# EAGLE board Arduino_kuukulgur-alternatiivne (EAGLE 6.3)
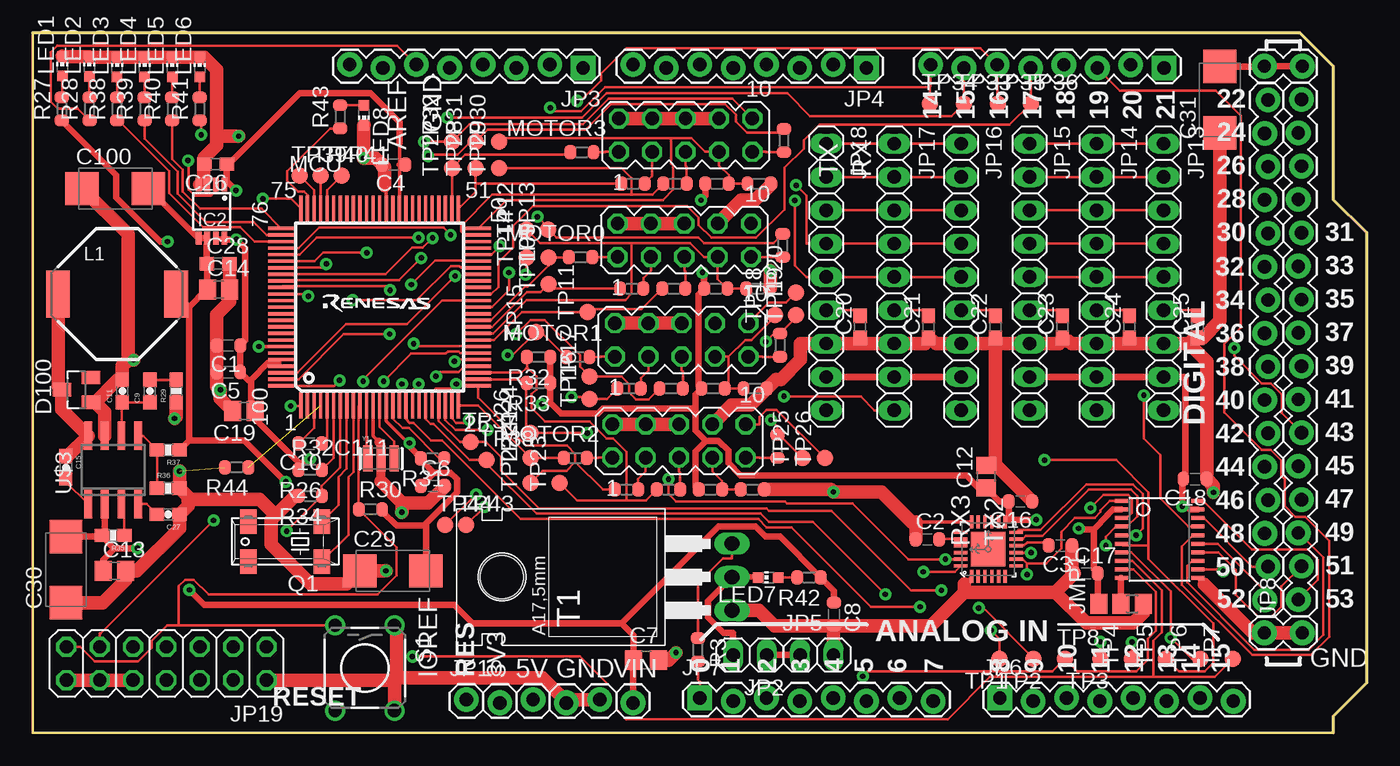
[diagram p7: board, top side]
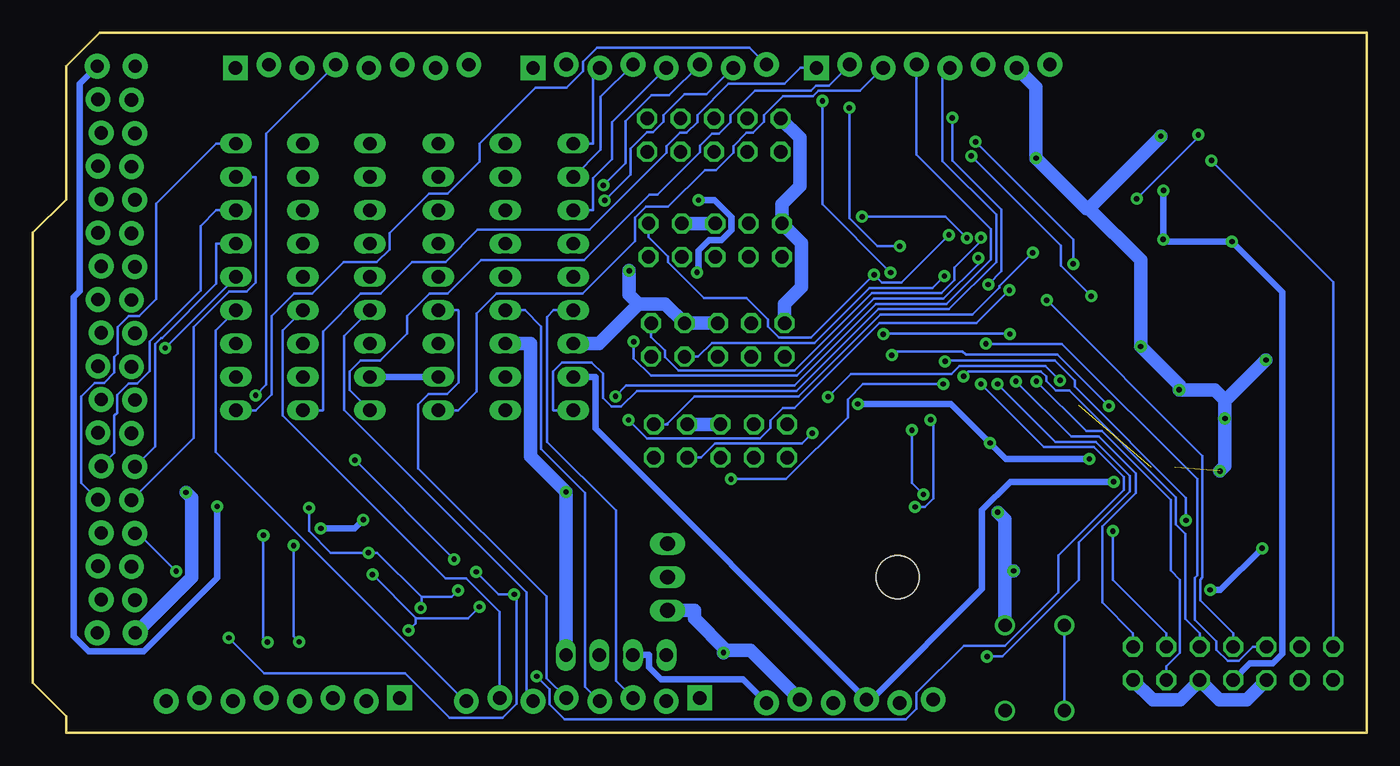
[diagram p8: board, bottom side, seen from below]

Size 101.6 x 53.34 mm. Coordinates in mm from the lower left corner, seen from the top.
Outline: 0,0 99.06,0 99.06,1.27 101.6,3.81 101.6,38.1 99.06,40.64 99.06,50.8 96.52,53.34 0,53.34 0,0
Copper layers (1*16): Top 0.035mm / dielectric 1.5mm / Bottom 0.035mm
Design rules "default": minimum track width 8mil, minimum drill 16mil, track to track 6mil, track to pad 7mil, pad to pad 8mil, via to via 10mil, smd to smd 7mil, copper to edge 27mil, drill to drill 12mil, minimum pad ring 10mil, minimum via ring 10mil, stop-mask expansion 2mil, vias tented up to drill 24mil, thermal gap 10mil
Net classes: 0 default: width 0.203 mm, drill 0.203 mm, clearance 0.203 mm; 1 power: width 0.508 mm, drill 0.508 mm, clearance 0.203 mm; 2 morepower: width 1.016 mm, drill 0.508 mm, clearance 0.203 mm; 3 gnd: width 0.305 mm, drill 0.305 mm, clearance 0.203 mm

## Footprints (pad centres in the part's own frame; a part is rotated, then mirrored left to right if it is on the bottom)
C0603-ROUND = smd 0.898 x 1.1: 1 -0.889,0; 2 0.889,0
C0805 = smd 1.3 x 1.5: 1 -0.95,0; 2 0.95,0
0603-CAP = smd 1.1 x 1: 1 -0.85,0; 2 0.85,0
C0805' = smd 1.3 x 1.5: 1 -0.85,0; 2 0.85,0
C0603 = smd 1.1 x 1: 1 -0.85,0; 2 0.85,0
C/6032-28R = smd 2.55 x 2.5: + 2.525,0; - -2.525,0
SOT23 = smd 1 x 1.4: 1 -0.95,-1.1; 2 0.95,-1.1; 3 0,1.1
MSOP8 = smd 0.45 x 1: 1 -0.975,-2.05; 2 -0.325,-2.05; 3 0.325,-2.05; 4 0.975,-2.05; 5 0.975,2.05; 6 0.325,2.05; 7 -0.325,2.05; 8 -0.975,2.05
B0R-JMP = smd 1.5 x 1.3: 1 0,1.7; 2 0,0; 3 0,-1.7
1X08_LOCK = drill 1.016 pad 1.88 square: 1 0,0.127 | drill 1.016 pad 1.88: 2 2.54,-0.127; 3 5.08,0.127; 4 7.62,-0.127; 5 10.16,0.127; 6 12.7,-0.127; 7 15.24,0.127; 8 17.78,-0.127
1X02 = drill 1.016 long: 1 -1.27,0; 2 1.27,0
1X16_LOCK = drill 1.016 pad 1.88: 1 0,0.127; 2 2.54,-0.127; 3 5.08,0.127; 4 7.62,-0.127; 5 10.16,0.127; 6 12.7,-0.127; 7 15.24,0.127; 8 17.78,-0.127; 9 20.32,0.127; 10 22.86,-0.127; 11 25.4,0.127; 12 27.94,-0.127; 13 30.48,0.127; 14 33.02,-0.127; 15 35.56,0.127; 16 38.1,-0.127
1X06_LOCK = drill 1.016 pad 1.88: 1 0,0; 2 2.54,-0.254; 3 5.08,0; 4 7.62,-0.254; 5 10.16,0; 6 12.7,-0.254
1X02_LOCK = drill 1.016 pad 1.88: 1 -0.178,0; 2 2.718,0
1X09 = drill 1.016 long: 1 -10.16,0; 2 -7.62,0; 3 -5.08,0; 4 -2.54,0; 5 0,0; 6 2.54,0; 7 5.08,0; 8 7.62,0; 9 10.16,0
2X07 = drill 1.016 octagon: 1 -7.62,-1.27; 2 -7.62,1.27; 3 -5.08,-1.27; 4 -5.08,1.27; 5 -2.54,-1.27; 6 -2.54,1.27; 7 0,-1.27; 8 0,1.27; 9 2.54,-1.27; 10 2.54,1.27; 11 5.08,-1.27; 12 5.08,1.27; 13 7.62,-1.27; 14 7.62,1.27
SRU1038 = smd 1.8 x 3.6: 1 -4.5,0; 2 4.5,0
CHIP-LED0603 = smd 0.8 x 0.8: A 0,-0.75; C 0,0.75
100P6Q-A = smd 0.25 x 2: 1 -6,-7.5; 2 -5.5,-7.5; 3 -5,-7.5; 4 -4.5,-7.5; 5 -4,-7.5; 6 -3.5,-7.5; 7 -3,-7.5; 8 -2.5,-7.5; 9 -2,-7.5; 10 -1.5,-7.5; 11 -1,-7.5; 12 -0.5,-7.5; 13 0,-7.5; 14 0.5,-7.5; 15 1,-7.5; 16 1.5,-7.5; 17 2,-7.5; 18 2.5,-7.5; 19 3,-7.5; 20 3.5,-7.5; 21 4,-7.5; 22 4.5,-7.5; 23 5,-7.5; 24 5.5,-7.5; 25 6,-7.5; 51 6,7.5; 52 5.5,7.5; 53 5,7.5; 54 4.5,7.5; 55 4,7.5; 56 3.5,7.5; 57 3,7.5; 58 2.5,7.5; 59 2,7.5; 60 1.5,7.5; 61 1,7.5; 62 0.5,7.5; 63 0,7.5; 64 -0.5,7.5; 65 -1,7.5; 66 -1.5,7.5; 67 -2,7.5; 68 -2.5,7.5; 69 -3,7.5; 70 -3.5,7.5; 71 -4,7.5; 72 -4.5,7.5; 73 -5,7.5; 74 -5.5,7.5; 75 -6,7.5 | smd 2 x 0.25: 26 7.5,-6; 27 7.5,-5.5; 28 7.5,-5; 29 7.5,-4.5; 30 7.5,-4; 31 7.5,-3.5; 32 7.5,-3; 33 7.5,-2.5; 34 7.5,-2; 35 7.5,-1.5; 36 7.5,-1; 37 7.5,-0.5; 38 7.5,0; 39 7.5,0.5; 40 7.5,1; 41 7.5,1.5; 42 7.5,2; 43 7.5,2.5; 44 7.5,3; 45 7.5,3.5; 46 7.5,4; 47 7.5,4.5; 48 7.5,5; 49 7.5,5.5; 50 7.5,6; 76 -7.5,6; 77 -7.5,5.5; 78 -7.5,5; 79 -7.5,4.5; 80 -7.5,4; 81 -7.5,3.5; 82 -7.5,3; 83 -7.5,2.5; 84 -7.5,2; 85 -7.5,1.5; 86 -7.5,1; 87 -7.5,0.5; 88 -7.5,0; 89 -7.5,-0.5; 90 -7.5,-1; 91 -7.5,-1.5; 92 -7.5,-2; 93 -7.5,-2.5; 94 -7.5,-3; 95 -7.5,-3.5; 96 -7.5,-4; 97 -7.5,-4.5; 98 -7.5,-5; 99 -7.5,-5.5; 100 -7.5,-6
MA05-2 = drill 1.016 octagon: 1 -5.08,-1.27; 2 -5.08,1.27; 3 -2.54,-1.27; 4 -2.54,1.27; 5 0,-1.27; 6 0,1.27; 7 2.54,-1.27; 8 2.54,1.27; 9 5.08,-1.27; 10 5.08,1.27
MM20SS = smd 1.27 x 1.88: 1 -2.794,-1.524; 2 2.794,-1.524; 3 2.794,1.524; 4 -2.794,1.524
R0603-ROUND = smd 0.898 x 1.1: 1 -0.889,0; 2 0.889,0
0603-RES = smd 1.1 x 1: 1 -0.85,0; 2 0.85,0
TACTILE-PTH = drill 1.016: 1 -3.251,2.261; 2 3.251,2.261; 3 -3.251,-2.261; 4 3.251,-2.261
TO220 = drill 1.118 long: 1 -2.54,-6.35; 2 0,-6.35; 3 2.54,-6.35 | hole 3.302: 0,11.176
B1,27 = smd 1.27 x 1.27: TP 0,0
QFN-24-TESTING = smd 1.016 x 0.254: 1 -2.066,1.257; 2 -2.066,0.75; 3 -2.066,0.247; 4 -2.066,-0.287; 5 -2.066,-0.792; 6 -2.066,-1.297; 13 2.086,-1.297; 14 2.086,-0.792; 15 2.086,-0.287; 16 2.086,0.247; 17 2.086,0.75; 18 2.086,1.257 | smd 0.254 x 1.016: 7 -1.267,-2.122; 8 -0.762,-2.122; 9 -0.258,-2.122; 10 0.278,-2.122; 11 0.78,-2.122; 12 1.287,-2.122; 19 1.287,2.082; 20 0.78,2.082; 21 0.278,2.082; 22 -0.258,2.082; 23 -0.762,2.082; 24 -1.267,2.082 | smd 2.616 x 2.616: P$1 0.02,-0.01
TSSOP20 = smd 0.305 x 0.991: 1 -2.925,-2.918; 2 -2.275,-2.918; 3 -1.625,-2.918; 4 -0.975,-2.918; 5 -0.325,-2.918; 6 0.325,-2.918; 7 0.975,-2.918; 8 1.625,-2.918; 9 2.275,-2.918; 10 2.925,-2.918; 11 2.925,2.918; 12 2.275,2.918; 13 1.625,2.918; 14 0.975,2.918; 15 0.325,2.918; 16 -0.325,2.918; 17 -0.975,2.918; 18 -1.625,2.918; 19 -2.275,2.918; 20 -2.925,2.918
SO8 = smd 0.6 x 2.2: 1 -1.905,-2.6; 2 -0.635,-2.6; 3 0.635,-2.6; 4 1.905,-2.6; 5 1.905,2.6; 6 0.635,2.6; 7 -0.635,2.6; 8 -1.905,2.6
RESONATOR = smd 0.7 x 2: 1 -1,0; 2 0,0; 3 1,0

## Placement (x,y rotation side)
C1  100n  [C0603-ROUND]  14.91,29.52 180 top
C2  2.2nF, 50V  [C0603-ROUND]  68.14,14.74 0 top
C3  100n  [C0603-ROUND]  78.26,14.27 180 top
C4  100n  [C0603-ROUND]  27.48,43.31 180 top
C5  100n  [C0603-ROUND]  14.91,27.49 180 top
C6  100n  [C0603-ROUND]  30.46,18.8 0 top
C7  47uF/16V  [C0805]  46.72,5.54 0 top
C8  100n  [C0603-ROUND]  61.02,9.04 270 top
C9  180pF  [0603-CAP]  8.92,26.04 90 top
C10  4,7uF  [C0603-ROUND]  21.12,22.04 180 top
C11  12pF  [0603-CAP]  6.82,26.04 90 top
C12  47uF  [C0805']  72.6,19.53 90 top
C13  47uF/16V  [C0805']  6.22,12.34 0 top
C14  47uF  [C0805']  14.16,33.78 0 top
C15  0.1  [0603-CAP]  2.52,20.24 270 top
C16  100n  [C0603-ROUND]  75.22,17.64 180 top
C17  100n  [C0603-ROUND]  80.22,12.14 0 top
C18  100n  [C0603-ROUND]  88.52,19.34 180 top
C19  47uF  [C0805']  16.08,24.53 180 top
C20  [C0603]  63.02,30.94 90 top
C21  [C0603]  68.22,30.94 90 top
C22  [C0603]  73.32,30.94 90 top
C23  [C0603]  78.42,30.94 90 top
C24  [C0603]  83.52,30.94 90 top
C25  [C0603]  88.72,30.94 90 top
C26  1uF/6V  [C0603]  13.92,43.34 180 top
C27  15nF  [0603-CAP]  10.32,16.64 180 top
C28  1uF/6V  [C0603]  14.12,35.74 0 top
C29  47uF/16V  [C/6032-28R]  27.42,12.34 0 top
C30  47uF/16V  [C/6032-28R]  2.52,12.44 90 top
C31  47uF/10V  [C/6032-28R]  90.42,48.24 90 top
C100  47uF/10V  [C/6032-28R]  6.29,41.47 0 top
D100  BAT54  [SOT23]  3.32,26.14 90 top
IC2  TPS77333DGK  [MSOP8]  13.62,39.74 180 top
JMP1  0R-JUMPB  [B0R-JMP]  82.89,9.83 90 top
JP1  [1X08_LOCK]  86.16,50.78 180 top
JP2  [1X02]  54.62,5.94 180 top
JP3  [1X08_LOCK]  41.91,50.8 180 top
JP4  [1X08_LOCK]  63.5,50.8 180 top
JP5  [1X02]  59.72,5.94 0 top
JP6  [1X08_LOCK]  73.66,2.54 0 top
JP7  [1X08_LOCK]  50.8,2.54 0 top
JP8  M16LOCK  [1X16_LOCK]  96.52,10.16 90 top
JP9  M16LOCK  [1X16_LOCK]  93.96,48.22 270 top
JP10  [1X06_LOCK]  33.02,2.54 0 top
JP11  [1X02_LOCK]  93.98,7.62 0 top
JP12  [1X02_LOCK]  93.98,50.8 0 top
JP13  [1X09]  86.12,34.74 270 top
JP14  [1X09]  81.02,34.74 270 top
JP15  [1X09]  75.92,34.74 270 top
JP16  [1X09]  70.72,34.74 270 top
JP17  [1X09]  65.62,34.74 270 top
JP18  [1X09]  60.42,34.74 270 top
JP19  [2X07]  10.18,5.29 180 top
L1  [SRU1038]  6.42,33.44 0 top
LED1  Red  [CHIP-LED0603]  2.25,50.79 0 top
LED2  Green  [CHIP-LED0603]  4.31,50.78 0 top
LED3  Green  [CHIP-LED0603]  6.42,50.74 0 top
LED4  Green  [CHIP-LED0603]  8.52,50.74 0 top
LED5  Green  [CHIP-LED0603]  10.62,50.74 0 top
LED6  Green  [CHIP-LED0603]  12.72,50.74 0 top
LED7  Yellow  [CHIP-LED0603]  56.02,11.84 90 top
LED8  Green  [CHIP-LED0603]  25.22,47.04 180 top
MCU  R32C111  [100P6Q-A]  26.42,32.44 0 top
MOTOR0  [MA05-2]  49.62,37.54 0 top
MOTOR1  [MA05-2]  49.42,29.94 0 top
MOTOR2  [MA05-2]  49.22,22.24 0 top
MOTOR3  [MA05-2]  49.72,45.54 0 top
Q1  [MM20SS]  19.22,14.58 180 top
R1  82R  [R0603-ROUND]  48.62,26.24 0 top
R2  82R  [R0603-ROUND]  48.82,33.84 0 top
R3  1k2  [R0603-ROUND]  50.66,6.34 270 top
R4  220R  [R0603-ROUND]  55.02,26.24 0 top
R5  220R  [R0603-ROUND]  51.82,26.24 0 top
R6  82R  [R0603-ROUND]  45.42,26.24 0 top
R7  180R  [R0603-ROUND]  41.52,28.64 0 top
R8  220R  [R0603-ROUND]  56.92,29.54 90 top
R9  220R  [R0603-ROUND]  55.22,33.84 0 top
R10  220R  [R0603-ROUND]  52.02,33.84 0 top
R11  82R  [R0603-ROUND]  45.62,33.84 0 top
R12  180R  [R0603-ROUND]  41.72,36.24 0 top
R13  220R  [R0603-ROUND]  57.12,37.14 90 top
R14  82R  [R0603-ROUND]  48.92,41.84 0 top
R15  220R  [R0603-ROUND]  55.32,41.84 0 top
R16  220R  [R0603-ROUND]  52.12,41.84 0 top
R17  82R  [R0603-ROUND]  45.72,41.84 0 top
R18  180R  [R0603-ROUND]  41.82,44.24 0 top
R19  220R  [R0603-ROUND]  57.22,45.14 90 top
R20  82R  [R0603-ROUND]  48.42,18.54 0 top
R21  220R  [R0603-ROUND]  54.82,18.54 0 top
R22  220R  [R0603-ROUND]  51.62,18.54 0 top
R23  82R  [R0603-ROUND]  45.22,18.54 0 top
R24  180R  [R0603-ROUND]  41.32,20.94 0 top
R25  220R  [R0603-ROUND]  56.72,21.84 90 top
R26  4k7  [R0603-ROUND]  21.12,20.04 180 top
R27  330r  [R0603-ROUND]  2.22,47.54 90 top
R28  330r  [R0603-ROUND]  4.32,47.54 90 top
R29  63k4  [0603-RES]  10.92,26.04 90 top
R30  4k7  [R0603-ROUND]  25.72,17.04 0 top
R31  4k7  [R0603-ROUND]  30.45,20.93 180 top
R32  4k7  [R0603-ROUND]  38.52,28.64 180 top
R33  4k7  [R0603-ROUND]  38.52,26.64 180 top
R34  4k7  [R0603-ROUND]  21.12,18.04 180 top
R35  100k  [0603-RES]  6.12,15.04 180 top
R36  1k87  [0603-RES]  10.32,18.64 0 top
R37  10k  [0603-RES]  10.32,21.57 180 top
R38  330r  [R0603-ROUND]  6.42,47.54 90 top
R39  330r  [R0603-ROUND]  8.52,47.54 90 top
R40  330r  [R0603-ROUND]  10.62,47.54 90 top
R41  330r  [R0603-ROUND]  12.72,47.54 90 top
R42  1k  [R0603-ROUND]  59.12,11.84 180 top
R43  330r  [R0603-ROUND]  23.42,46.94 90 top
R44  47k  [R0603-ROUND]  15.52,20.24 180 top
S1  [TACTILE-PTH]  25.29,4.94 270 top
T1  BD651  [TO220]  46.9,11.87 90 top
TP1  TPB1,27  [B1,27]  73.62,5.64 180 top
TP2  TPB1,27  [B1,27]  76.22,5.64 180 top
TP3  TPB1,27  [B1,27]  81.32,5.64 180 top
TP4  TPB1,27  [B1,27]  83.72,5.64 90 top
TP5  TPB1,27  [B1,27]  86.32,5.64 90 top
TP6  TPB1,27  [B1,27]  88.92,5.64 90 top
TP7  TPB1,27  [B1,27]  91.42,5.64 90 top
TP8  TPB1,27  [B1,27]  78.62,5.64 0 top
TP9  TPB1,27  [B1,27]  39.28,36.2 90 top
TP10  TPB1,27  [B1,27]  39.28,34.2 90 top
TP11  TPB1,27  [B1,27]  42.25,32.07 90 top
TP12  TPB1,27  [B1,27]  37.6,38.35 90 top
TP13  TPB1,27  [B1,27]  39.26,38.34 90 top
TP14  TPB1,27  [B1,27]  37.6,36.2 90 top
TP15  TPB1,27  [B1,27]  38.32,30.54 90 top
TP16  TPB1,27  [B1,27]  42.42,25.44 90 top
TP17  TPB1,27  [B1,27]  42.42,27.14 90 top
TP18  TPB1,27  [B1,27]  56.52,31.84 90 top
TP19  TPB1,27  [B1,27]  58.12,31.84 90 top
TP20  TPB1,27  [B1,27]  58.12,33.54 90 top
TP21  TPB1,27  [B1,27]  37.92,20.94 90 top
TP22  TPB1,27  [B1,27]  37.92,19.04 90 top
TP23  TPB1,27  [B1,27]  40.12,19.04 90 top
TP24  TPB1,27  [B1,27]  37.92,22.84 90 top
TP25  TPB1,27  [B1,27]  58.62,20.94 90 top
TP26  TPB1,27  [B1,27]  60.32,20.94 90 top
TP27  TPB1,27  [B1,27]  31.92,43.04 90 top
TP28  TPB1,27  [B1,27]  33.72,43.04 90 top
TP29  TPB1,27  [B1,27]  35.52,43.04 90 top
TP30  TPB1,27  [B1,27]  35.52,45.04 90 top
TP31  TPB1,27  [B1,27]  33.72,45.04 90 top
TP32  TPB1,27  [B1,27]  31.92,45.04 90 top
TP33  TPB1,27  [B1,27]  70.92,47.94 0 top
TP34  TPB1,27  [B1,27]  68.32,47.94 0 top
TP35  TPB1,27  [B1,27]  73.52,47.94 0 top
TP36  TPB1,27  [B1,27]  76.02,47.94 0 top
TP37  TPB1,27  [B1,27]  33.34,22.15 0 top
TP38  TPB1,27  [B1,27]  34.57,20.8 0 top
TP39  TPB1,27  [B1,27]  20.32,42.44 0 top
TP40  TPB1,27  [B1,27]  21.92,42.44 0 top
TP41  TPB1,27  [B1,27]  23.52,42.44 0 top
TP43  TPB1,27  [B1,27]  33.02,15.84 0 top
TP44  TPB1,27  [B1,27]  31.42,15.84 0 top
U1  MPU-6000QFN-24  [QFN-24-TESTING]  72.77,13.99 90 top
U2  txb0108  [TSSOP20]  85.82,14.74 270 top
U$3  TPS54233  [SO8]  6.12,20.04 0 top
Y1  CSTCE8M00G15C99-R0  [RESONATOR]  26.52,20.91 0 top

## Tracks (layer width: path | path; a pad name or v marks a point on that pad's centre or on a via)
+3V3  (via drill 0.41 pad 0.91)
  Top 0.203: 14.77,41.88 14.77,42.1 | IC2.1 14.68,41.88
  Top 0.25: MCU.60 27.92,43.31 27.92,44.92 | MCU.14 26.92,23.77 28.6,22.09 v28.69,22.09 | MCU.97 18.69,28.17 18.69,28.21 MCU.96
  Top 0.254: 74.28,16.29 U1.13
  Top 0.3: IC2.7 IC2.8
  Top 0.508: 39.41,25.17 38.87,25.17 v38.77,25.06 | 50.49,24.73 43.44,24.73 43.05,24.34 40.23,24.34 39.41,25.17 | 39.41,25.17 R33.1 R32.1 | 20.38,20.46 20.8,20.87 v21.12,20.87 | R30.2 26.61,16.89 27.7,15.8 29.95,15.8 | 29.95,15.8 29.95,15.96 32.31,18.33 32.31,19.33 31.83,19.81 30.58,19.81 | C29.+ 29.95,15.8 | 20.38,20.46 20.23,20.3 R26.2 | 17.09,24.38 C19.1 16.61,24.85 16.61,26.88 | 17.09,24.38 | 17.09,24.38 17.09,23.75 20.38,20.46 | 51.28,22.24 52.24,22.24 52.98,21.5 52.98,20.56 53.91,19.63 71.09,19.63 72.04,18.68 C12.1 73.64,17.64 C16.2 74.33,16.29 | v15.48,41.33 14.93,41.88 14.77,41.88 14.68,41.88 | IC2.8 14.69,37.59 v15.51,37.59 16.16,36.93 16.16,29.89 C1.1 C5.1 16.41,26.88 16.61,26.88 | 18.69,28.17 17.9,28.17 16.61,26.88 | v10.27,37.43 9.72,37.43 6.36,40.79 6.36,42.51 R27.1 | v28.69,22.09 28.69,21.81 R31.2 29.56,20.82 30.58,19.81 | 74.33,16.29 74.28,16.29 | v76.43,16.24 74.38,16.24 74.33,16.29 | 30.58,19.81 C6.1 | 51.28,22.24 50.49,21.45 50.49,18.78 R22.1 | 51.28,22.24 50.49,23.04 50.49,24.73 | 50.49,24.73 50.49,25.8 R5.1 50.69,26.48 50.69,33.4 R10.1 51.13,34.96 v51.01,35.09 | v50.89,40.59 51.23,40.93 R16.1 | JMP1.1 81.11,9.91 C17.2 80.81,12.44 80.81,15.52 | 14.77,42.1 C26.1 14.92,43.34 20.31,48.74 25.72,48.74 27.92,46.54 27.92,44.92 | 27.92,43.31 C4.1 | v79.67,15.58 79.73,15.52 80.81,15.52 | 80.81,15.52 81.88,16.6 81.88,16.64 82.26,17.02 U2.2
  Bottom 0.508: v38.77,25.06 31.66,25.06 v28.69,22.09 27.47,20.87 v21.12,20.87 | v15.48,41.33 15.51,41.3 v15.51,37.59 15.34,37.43 v10.27,37.43 6.42,33.58 6.42,6.02 7.15,5.29 8.91,5.29 JP19.8 | v50.89,40.59 49.66,40.59 48.38,39.31 48.38,38.29 49.13,37.54 50.1,37.54 50.89,36.76 50.89,35.21 v51.01,35.09 | v76.43,16.24 77.09,15.58 v79.67,15.58
+5V  (via drill 0.41 pad 0.91)
  Top 0.203: 13.25,37.2 13.29,37.24 IC2.6 12.97,37.69
  Top 0.305: 87.78,17.26 87.89,17.26 88.14,17.02
  Top 0.508: 11.9,22.3 16.1,22.3 v19.27,19.13 | 11.9,22.3 R37.1 | 11.9,32.46 11.9,22.3 | JP16.8 JP17.8 JP18.8 | 87.61,19.23 87.59,19.08 87.56,18.91 v87.56,17.26 87.78,17.26 | 87.61,19.23 | 87.61,19.23 C18.2 87.8,19.51 87.8,27.12 JP13.8 JP14.8 JP15.8 | C31.+ 93.77,50.77 JP12.1 JP12.2 | U2.19 88.14,17.02 | 12.97,37.69 IC2.5 12.6,37.69 C100.+ | L1.2 11.9,32.46 | 13.25,37.2 13.25,35.76 C28.1 13.27,33.78 | 11.9,32.46 13.22,33.78 13.27,33.78 | 13.27,33.78 C14.1
  Bottom 0.508: v19.27,19.13 27.15,19.13 29.3,16.97 29.3,10.97 37.73,2.54 JP10.3 58.74,23.18 58.74,27.12 JP18.8 | JP12.2 98.04,49.45 98.04,33.66 98.48,33.22 98.48,7.36 97.34,6.22 93.15,6.22 87.56,11.8 v87.56,17.26 | JP15.8 JP16.8
_CLK0
  Top 0.203: MCU.35 34.98,30.94 37.65,33.61 38.69,33.61 TP10.TP 39.75,33.84 R11.1
_CLK2
  Top 0.203: R23.1 43.42,18.54 41.32,20.64 | 41.32,20.64 41.32,21.25 40.68,21.89 37.58,21.89 33.92,25.55 MCU.26 | TP22.TP 38.84,19.96 40.64,19.96 41.32,20.64
_CLK3
  Top 0.203: 33.72,41.84 33.72,41.24 MCU.51 | TP28.TP 33.72,41.84 | R17.1 33.72,41.84
_CLK4  (via drill 0.41 pad 0.91)
  Top 0.203: v41.03,25.6 42.26,25.6 TP16.TP 43.73,25.44 R6.1 | v23.36,26.86 22.94,26.44 MCU.100
  Bottom 0.203: v41.03,25.6 39.28,27.35 31.64,27.35 31.02,27.96 24.46,27.96 v23.36,26.86
_CRESET0  (via drill 0.41 pad 0.91)
  Top 0.203: MCU.83 26.87,34.94 28.89,36.96 29.7,36.96 v30.46,37.71 | v38.43,39.33 39.26,38.5 TP13.TP 39.88,37.72 50.72,37.72 51.13,37.32 56.41,37.32 R13.2
  Bottom 0.203: v38.43,39.33 32.07,39.33 v30.46,37.71
_CRESET1  (via drill 0.41 pad 0.91)
  Top 0.203: v29.58,36.19 27.88,34.49 18.97,34.49 MCU.84 | TP19.TP 58.12,31.63 R8.2 56.46,30.43 v55.83,29.8
  Bottom 0.203: v55.83,29.8 55.83,28.52 54.53,27.22 43.41,27.22 37.53,33.09 32.23,33.09 29.58,35.74 v29.58,36.19
_CRESET2  (via drill 0.41 pad 0.91)
  Top 0.203: v56.22,23.84 56.72,23.34 R25.2 56.83,22.73 TP25.TP | v27.21,33.73 26.91,34.03 19.01,34.03 MCU.85
  Bottom 0.203: v27.21,33.73 29.72,31.22 37.11,31.22 43.57,24.76 44.47,24.76 45.41,23.82 45.41,23.23 46.2,22.44 54.82,22.44 v56.22,23.84
_CRESET3  (via drill 0.41 pad 0.91)
  Top 0.203: MCU.86 20.81,33.44 v20.99,33.27 | v30.12,43.95 30.21,44.04 32.34,44.04 33.34,45.04 TP31.TP 34.65,45.97 42.11,45.97 44.06,47.92 52.73,47.92 53.54,47.1 53.54,46.56 54.38,45.72 56.91,45.72 R19.2
  Bottom 0.203: v30.12,43.95 23.31,37.14 23.31,35.59 v20.99,33.27
_CS0
  Top 0.203: MCU.36 34.91,31.44 37.48,34.01 37.7,34.01 39.28,35.59 TP9.TP 40.79,36.2 R12.1
_CS2
  Top 0.203: R24.1 TP21.TP 33.92,24.94 MCU.25
_CS3
  Top 0.203: R18.1 40.73,44.04 32.92,44.04 TP27.TP MCU.52
_CS4  (via drill 0.41 pad 0.91)
  Top 0.203: v36.18,28.77 36.55,28.77 TP15.TP 38.73,30.54 R7.1 | v19.64,24.91 20.39,24.91 MCU.1
  Bottom 0.203: v36.18,28.77 35.88,29.07 30.78,29.07 30.53,28.82 23.54,28.82 v19.64,24.91
_MISO0
  Top 0.203: 45.62,37.32 45.62,33.48 45.13,32.99 37.61,32.99 35.06,30.44 MCU.34 | R9.1 R10.2 52.16,34.59 MOTOR0.7 51.12,36.27 50.07,37.32 45.62,37.32 | TP12.TP 38.63,37.32 45.62,37.32
_MISO2  (via drill 0.41 pad 0.91)
  Top 0.203: 37.57,26.58 R33.2 | 37.57,26.58 37.57,23.19 TP24.TP v42.22,22.84 | 37.57,26.58 37.21,26.94 MCU.27 | MOTOR2.7 51.76,19.93 52.51,19.18 R22.2 R21.1
  Bottom 0.203: v42.22,22.84 43.02,22.04 49.65,22.04 50.72,20.97 MOTOR2.7
_MISO3
  Top 0.203: 48.61,45.31 48.61,43.37 48.78,43.21 48.78,41.39 47.98,40.6 36.08,40.6 MCU.50 | TP30.TP 35.79,45.31 48.61,45.31 | R15.1 R16.2 53.01,42.48 52.26,43.23 MOTOR3.7 51.22,44.27 50.18,45.31 48.61,45.31
_MISO4  (via drill 0.41 pad 0.91)
  Top 0.203: v32.17,34.81 28.51,31.16 23.87,31.16 20.16,27.44 MCU.98 | 53,26.24 R4.1 | R5.2 53,26.24 | 53,26.24 53,28.67 | MOTOR1.7 53,28.67 | TP18.TP 56.52,31.73 54.73,29.94 54.27,29.94 53,28.67
  Bottom 0.203: v32.17,34.81 33.07,33.91 37.87,33.91 42.07,29.71 49.88,29.71 50.92,28.67 MOTOR1.7
_MOSI0
  Top 0.203: MCU.33 35.13,29.94 37.27,32.07 TP11.TP 42.45,32.28 46.37,32.28 R2.1
_MOSI2
  Top 0.203: 37.63,27.76 37.74,27.76 38.36,27.14 38.36,26.17 38,25.81 38,24.75 39.02,23.73 42.41,23.73 43.7,22.44 44.2,22.44 45.22,21.42 45.22,17.71 | MCU.28 37.24,27.44 37.56,27.76 37.63,27.76 | 37.63,27.76 R32.2 | 45.22,17.71 46.7,17.71 R20.1 | TP23.TP 41.45,17.71 45.22,17.71
_MOSI3
  Top 0.203: MCU.49 32.9,37.94 32.61,38.23 32.61,38.62 35,41.01 45.61,41.01 | TP29.TP 44.83,43.04 45.61,42.27 45.61,41.01 | R14.1 47.2,41.01 45.61,41.01
_MOSI4  (via drill 0.41 pad 0.91)
  Top 0.203: MCU.99 20.23,26.94 23.68,30.39 v27.18,30.39 | v36.82,30.38 37.91,31.47 38.99,31.47 41.66,28.8 41.66,27.9 TP17.TP 44.85,27.14 45.42,26.57 45.42,25.92 45.93,25.41 46.9,25.41 R1.1
  Bottom 0.203: v36.82,30.38 36.75,30.45 27.23,30.45 v27.18,30.39
A0
  Top 0.203: JP7.1 50.8,3.89 50.66,4.03 R3.2
A2
  Top 0.203: JP18.6 62.61,32.2 C20.2
  Bottom 0.203: JP7.3 57.17,3.96 57.17,16.94 62.42,22.18 62.42,31.7 61.92,32.2 JP18.6
A3
  Top 0.203: JP17.6 67.81,32.2 C21.2
  Bottom 0.203: JP17.6 64.12,32.2 62.88,30.96 62.88,21.65 59.52,18.3 59.52,3.52 JP7.4
A4
  Top 0.203: JP16.6 72.91,32.2 C22.2
  Bottom 0.203: JP7.5 62.45,4.16 62.45,10.38 72.23,20.17 72.23,25.04 71.44,25.84 70.03,25.84 69.17,26.7 69.17,32.15 69.22,32.2 JP16.6
A5
  Top 0.203: JP15.6 78.01,32.2 C23.2
  Bottom 0.203: JP7.6 63.98,2.89 63.98,10.69 77.89,24.6 77.89,30.23 JP15.6
A6
  Top 0.203: JP14.6 83.11,32.2 C24.2
  Bottom 0.203: JP14.6 82.56,30.66 82.56,24.17 70.16,11.76 68.6,11.76 66.04,9.2 JP7.7
A7
  Top 0.203: JP13.6 88.31,32.2 C25.2
  Bottom 0.203: JP13.6 87.67,30.65 87.67,21.41 68.67,2.41 JP7.8
CDONE0  (via drill 0.41 pad 0.91)
  Top 0.203: MCU.79 20.26,36.94 21.81,38.49 31.27,38.49 v31.82,37.95 | TP14.TP 37.6,35 v37.52,34.91
  Bottom 0.203: v31.82,37.95 35.45,34.31 36.92,34.31 v37.52,34.91 42.31,30.12 44.76,30.12 45.61,30.96 45.61,31.48 47.24,33.11 50.48,33.11 53.23,35.86 53.23,36.29 54.7,37.77 MOTOR0.10
CDONE1  (via drill 0.41 pad 0.91)
  Top 0.203: MCU.80 20.33,36.44 21.62,37.72 v29.39,37.72 | TP20.TP 57.35,32.77 56.06,32.77 MOTOR1.10
  Bottom 0.203: v29.39,37.72 29.39,37.46 31.39,35.46 31.39,34.51 32.4,33.5 37.7,33.5 43.58,27.62 52.43,27.62 53.46,28.65 53.46,29.13 54.5,30.17 MOTOR1.10
CDONE2  (via drill 0.41 pad 0.91)
  Top 0.203: MOTOR2.10 55.34,23.51 55.34,24.07 55.89,24.62 56.64,24.62 TP26.TP | MCU.81 21.48,35.94 22.12,36.58 v25.44,36.58
  Bottom 0.203: v25.44,36.58 27.97,34.04 27.97,33.93 30.03,31.87 37.03,31.87 43.26,25.64 51.2,25.64 53.26,23.58 53.26,23.51 MOTOR2.10
CDONE3  (via drill 0.41 pad 0.91)
  Top 0.203: MOTOR3.10 53.28,48.33 43.87,48.33 41.92,46.38 33.26,46.38 TP32.TP v29.79,45.04 | v22.35,35.74 22.05,35.44 MCU.82
  Bottom 0.203: v29.79,45.04 22.35,37.6 v22.35,35.74
CLK0
  Top 0.203: MOTOR0.3 47.08,35.23 46.51,34.66 R11.2
CLK1
  Top 0.203: MOTOR1.3 46.88,27.63 46.31,27.06 R6.2
CLK2
  Top 0.203: MOTOR2.3 46.68,19.93 46.11,19.36 R23.2
CLK3
  Top 0.203: R17.2 47.18,42.41 MOTOR3.3
CNVSS  (via drill 0.41 pad 0.91)
  Top 0.203: MCU.7 23.42,20.23 22.01,18.82 R34.1 19.35,15.38 v19.33,15.38
  Bottom 0.203: v19.33,15.38 19.33,11.67 15.26,7.6 JP19.3
CPOUT
  Top 0.203: U1.20 69.06,14.77 C2.2
CRESET0
  Top 0.203: MOTOR0.9 55.74,36.27 55.76,36.25 R13.1
CRESET1
  Top 0.203: MOTOR1.9 55.54,28.67 55.56,28.65 R8.1
CRESET2
  Top 0.203: MOTOR2.9 55.34,20.97 55.36,20.95 R25.1
CRESET3
  Top 0.203: MOTOR3.9 55.84,44.27 55.86,44.25 R19.1
CS0
  Top 0.203: MOTOR0.1 43.5,36.27 43.47,36.24 R12.2
CS1
  Top 0.203: MOTOR1.1 43.3,28.67 43.27,28.64 R7.2
CS2
  Top 0.203: MOTOR2.1 43.1,20.97 43.07,20.94 R24.2
CS3
  Top 0.203: MOTOR3.1 43.6,44.27 43.57,44.24 R18.2
CS_GYRO_3V  (via drill 0.41 pad 0.91)
  Top 0.203: MCU.17 28.42,23.92 28.71,23.63 29.01,23.63 30.34,22.29 31.16,22.29 37.16,16.29 55.26,16.29 55.9,15.65 57.79,15.65 63.85,9.6 v67.58,9.6 | TP1.TP 73.62,7.18 v72.99,7.81 | 75.73,12.92 75.42,13.23 U1.8 | 75.73,12.92 v75.73,12.06 | 75.73,12.92 77.22,12.92 78.34,14.04 78.34,15.33 79.39,16.38 80.88,16.38 81.33,16.83 81.33,16.97 82.02,17.67 U2.1
  Bottom 0.203: 72.44,8.72 68.46,8.72 v67.58,9.6 | 72.44,8.72 72.44,8.36 v72.99,7.81 | v75.73,12.06 72.44,8.77 72.44,8.72
CS_MOTOR_3V  (via drill 0.41 pad 0.91)
  Top 0.203: 85.36,4.27 72.92,4.27 69.69,1.04 45.19,1.04 44.45,1.78 44.45,3.06 41.7,5.81 v28.92,5.81 | TP7.TP 90.05,4.27 85.36,4.27 | U2.8 83.75,13.12 86.01,10.85 86.01,7.66 85.36,7 85.36,4.27 | v28.12,26.59 27.92,26.39 MCU.16
  Bottom 0.203: v28.12,26.59 23.71,22.18 20.61,22.18 18.03,19.59 18.03,18.39 21.92,14.5 21.92,11.65 27.76,5.81 v28.92,5.81
D2
  Top 0.203: JP16.1 JP17.1 JP18.1
  Bottom 0.203: JP18.1 58.92,44.9 58.92,50.17 JP4.3
D3
  Top 0.203: JP16.2 JP17.2 JP18.2
  Bottom 0.203: JP18.2 58.34,44.43 58.34,48.46 JP4.4
D4
  Top 0.203: JP16.3 JP17.3 JP18.3
  Bottom 0.203: JP4.5 57.48,46.53 57.48,43.7 58.92,42.27 58.92,39.82 JP18.3
D5  (via drill 0.41 pad 0.91)
  Top 0.203: v58.14,41.72 58.92,40.94 58.92,37.28 JP18.4 JP17.4 JP16.4
  Bottom 0.203: JP4.6 53.13,48.6 54.49,48.6 56.47,46.62 56.47,43.39 v58.14,41.72
D6  (via drill 0.41 pad 0.91)
  Top 0.203: v58.04,40.57 58.04,35.62 58.92,34.74 JP18.5 JP17.5 JP16.5
  Bottom 0.203: JP4.7 50.28,48.65 51.96,48.65 53.54,47.07 53.54,46.55 54.34,45.76 54.82,45.76 56.06,44.52 56.06,42.55 v58.04,40.57
D7
  Bottom 0.203: JP4.8 47,52.21 58.62,52.21 59.69,51.14 59.69,50.43 60.96,49.16 63.31,49.16 67.58,44.89 67.58,43.53 70.02,41.09 71.41,41.09 74.42,38.08 74.42,36.84 75.39,35.87 77.92,35.87 80.31,33.47 81.69,33.47 83.4,31.76 83.4,25.8 84.62,24.58 JP13.9
D8
  Bottom 0.203: JP3.1 43.13,50.67 44.35,49.45 48.6,49.45 50.99,47.06 50.99,46.55 51.81,45.73 52.3,45.73 53.31,44.71 53.31,44.22 59.2,38.33 67.71,38.33 70.18,35.87 72.71,35.87 75.11,33.47 76.62,33.47 79.5,30.6 79.5,24.61 79.52,24.58 JP14.9
D9
  Bottom 0.203: JP15.9 77.48,26.14 77.48,27.55 76.63,28.39 75.14,28.39 73.09,30.44 73.09,31.77 71.39,33.47 70.01,33.47 67.47,36.01 59.6,36.01 54.61,41 54.03,41 50.77,44.26 50.77,44.74 49.87,45.64 49.34,45.64 48.45,46.53 48.45,47.08 46.61,48.92 42.34,48.92 41.93,49.33 40.97,49.33 JP3.2
D10
  Bottom 0.203: JP3.3 38.58,48.92 41.77,48.92 42.17,48.51 44.45,48.51 45.9,47.06 45.9,46.55 46.73,45.72 47.22,45.72 48.23,44.71 48.23,44.22 49.57,42.88 50.4,42.88 53.2,40.08 54.9,40.08 55.74,39.24 55.74,37.47 59.74,33.47 66.28,33.47 67.8,31.96 67.8,26 69.22,24.58 JP16.9
D11  (via drill 0.41 pad 0.91)
  Top 0.203: JP17.9 64.12,24.58 63.06,25.64 v57.21,25.64
  Bottom 0.203: v57.21,25.64 56.4,26.45 43.6,26.45 37.37,32.69 32.01,32.69 28.63,36.07 28.63,38.38 34.29,44.04 JP3.4
D12
  Bottom 0.203: JP3.5 32.32,50.1 32.32,43.58 28.22,39.48 28.22,35.88 31.82,32.28 37.2,32.28 43.43,26.05 55.59,26.05 56.78,24.86 57.53,24.86 58.19,25.52 58.19,27.37 59.05,28.23 61.28,28.23 61.96,27.55 61.96,24.62 61.92,24.58 JP18.9
D13
  Top 0.203: R28.1 3.41,47.56 1.91,47.56 1.37,48.09 1.37,51.88 1.87,52.37 27.76,52.37 JP3.6
D18  (via drill 0.41 pad 0.91)
  Top 0.203: U2.17 88.03,15.71 85.89,17.85 85.89,21.17 84.62,22.44 v84.62,25.72
  Bottom 0.203: JP1.4 83.81,45.64 83.81,26.53 v84.62,25.72
D19
  Top 0.203: JP1.3 82.81,48.92 90.1,48.92 92,47.02 92,30.88 90.76,29.64 90.76,24.39 93.6,21.55 94.31,21.55 95.09,20.76 95.09,19.59 95.35,19.33 95.35,17.29 96.18,16.46 96.9,16.46 98.75,14.61 98.75,7.33 97.34,5.93 92.89,5.93 87.53,11.29 87.53,14.22 88.37,15.06 U2.16
D43  (via drill 0.41 pad 0.91)
  Top 0.203: v91.52,29.33 91.52,28.73 93.62,26.63 94.29,26.63 95.13,25.79 95.13,24.37 JP8.6 | JP15.5 JP14.5 JP13.5
  Bottom 0.203: JP13.5 91.52,29.34 v91.52,29.33
D44
  Top 0.203: JP13.4 JP14.4 JP15.4
  Bottom 0.203: JP9.12 92.28,21.83 92.28,29.64 91.83,30.09 91.75,30.09 87.62,34.22 87.62,37.28 JP13.4
D45
  Top 0.203: JP13.3 JP14.3 JP15.3
  Bottom 0.203: JP8.5 95.39,21.33 95.39,24.17 95.17,24.38 95.17,25.75 94.29,26.63 93.63,26.63 92.69,27.57 92.69,29.81 88.81,33.69 88.81,38.63 87.62,39.82 JP13.3
D46
  Top 0.203: JP13.2 JP14.2 JP15.2
  Bottom 0.203: JP13.2 84.62,42.36 84.62,34.3 85.31,33.61 86.64,33.61 89.35,30.9 89.35,22.48 JP9.13
D47
  Top 0.203: JP13.1 JP14.1 JP15.1
  Bottom 0.203: JP8.4 97.9,19.03 97.9,25.64 96.87,26.67 96.17,26.67 95.39,27.46 95.39,28.63 95.13,28.89 95.13,30.93 94.3,31.76 93.51,31.76 92.2,33.07 92.2,40.32 87.62,44.9 JP13.1
D48  (via drill 0.41 pad 0.91)
  Top 0.203: U2.12 90.53,12.46 v90.68,12.32
  Bottom 0.203: v90.68,12.32 93.56,15.2 JP9.14
D49
  Top 0.203: U2.13 88.33,13.12 87.94,12.72 87.94,11.46 93.06,6.33 97.18,6.33 98.29,7.45 98.29,13.36 96.42,15.24 JP8.3
D50
  Top 0.203: U2.18 89.18,16.37 92.89,12.66 JP9.15
D51
  Top 0.203: U2.14 90.31,13.76 91.64,12.43 91.64,10.53 93.3,8.87 94.37,8.87 95.09,9.6 95.09,11.15 JP8.2
D52
  Top 0.203: U2.15 90.25,14.41 93.83,10.83 JP9.16
D53
  Top 0.203: U2.20 89.16,17.67 92.85,13.97 97.11,13.97 97.88,13.2 97.88,11.65 JP8.1
E8_BUSY  (via drill 0.41 pad 0.91)
  Top 0.203: MCU.32 33.89,29.47 29.19,29.47 v29.01,29.65
  Bottom 0.203: v29.01,29.65 28.98,29.63 23.2,29.63 12.91,19.34 12.91,12 13.09,11.82 13.09,8.61 11.45,6.96 11.45,6.34 10.6,5.49 9.75,5.49 8.68,6.56 JP19.9
E8_CLK  (via drill 0.41 pad 0.91)
  Top 0.203: MCU.31 32.56,28.94 32.43,29.07 31.63,29.07 31.46,28.89 28.82,28.89 v26.72,26.79
  Bottom 0.203: v26.72,26.79 22.51,22.58 20.39,22.58 17.57,19.77 17.57,18.27 20.13,15.72 20.13,9.93 17.8,7.6 JP19.1
E8_RX  (via drill 0.41 pad 0.91)
  Top 0.203: JP19.11 5.1,7.6 5.17,7.6 v13.76,16.19 | MCU.30 32.25,28.44 v32.12,28.3
  Bottom 0.203: v32.12,28.3 32.05,28.37 23.75,28.37 22.22,26.83 22.22,26.38 13.76,17.92 v13.76,16.19
E8_TX  (via drill 0.41 pad 0.91)
  Top 0.203: MCU.29 32.89,27.94 32.43,27.48 31.01,27.48 v30.7,27.17
  Bottom 0.203: v30.7,27.17 30.32,27.55 24.81,27.55 24.4,27.14 24.4,26.82 23.68,26.1 22.66,26.1 14.52,17.96 14.52,15.87 13.81,15.16 13.81,8.69 12.72,7.6 JP19.5
ENABLE_PANDA
  Top 0.203: U$3.3 6.97,17.23 R35.1
FSYNC_3V  (via drill 0.41 pad 0.91)
  Top 0.203: U1.11 75.42,14.77 75.65,15 76.88,15 80.42,18.54 83.63,18.54 84.11,18.05 84.11,16.5 83.33,15.71 U2.4 82.51,15.71 81.73,14.94 v81.73,14.27 | v81.73,14.27 | TP3.TP v81.32,6.93
  Bottom 0.203: v81.73,14.27 81.73,7.34 v81.32,6.93
GND  (via drill 0.41 pad 0.91)  (1 unrouted)
  Top 0.203: IC2.3 13,42.09 13,42.12
  Top 0.25: MCU.94 v17.21,29.44 | MCU.62 26.92,41.54 26.78,41.68 | MCU.12 25.92,22.61 26.38,22.15
  Top 0.254: U1.18 67.25,16.08 66.93,16.08 | 70.96,11.37 U1.1
  Top 0.305: 89.22,11.33 U2.11
  Top 0.45: C26.2 | 12.7,41.79 IC2.4
  Top 0.7: 26.52,19.16 Y1.2 26.52,22.01 26.38,22.15
  Top 1.016: JP11.2 JP11.1 92.93,7.62 89.22,11.33 | v26.9,12.34 C29.- 23.91,11.35 21.17,11.35 18.16,14.36 18.16,16.22 18.51,16.56 | 11.84,17.8 11.84,17.31 C27.1 11.17,15.59 7.92,12.34 C13.2 7.07,11.67 5.31,9.91 C30.- | 11.84,17.8 11.84,17.97 R36.2 v11.17,19.95 | 18.51,16.56 17.27,17.8 11.84,17.8 | 28.14,17.54 28.14,16.84 v28.11,16.81 | R34.2 19.98,18.04 18.51,16.56 | 28.14,17.54 26.52,19.16 | C6.2 31.34,18.76 30.13,17.54 28.14,17.54 | v48.99,6.12 48.41,5.54 C7.2 | MOTOR1.2 MOTOR1.4 MOTOR1.6 | C8.2 56.48,8.15 55.3,9.33 T1.1 | R21.2 60.8,18.54 v60.99,18.36 64.65,18.36 66.93,16.08 | 14,45.47 14,50.53 13.04,51.49 LED6.C LED5.C LED4.C LED3.C 4.34,51.49 LED2.C 2.26,51.53 LED1.C | C31.- 90.42,31.4 89.11,30.09 C25.1 88.48,30.09 88.05,29.66 | 88.05,29.66 89.41,28.3 C18.1 89.93,18.82 v89.93,18.32 | 73.32,20.39 73.39,20.39 76.11,17.68 C16.1 | 73.32,29.66 73.32,20.39 | 73.32,20.39 72.62,20.39 C12.2 | JP5.2 60.99,7.87 61.02,7.9 C8.2 | 88.05,29.66 JP13.7 83.52,29.66 | 27.73,4.19 38.82,4.19 40.64,2.38 JP10.4 40.89,2.54 JP10.5 | 27.55,4.02 27.73,4.19 | S1.1 27.73,8.02 27.73,4.19 | C2.1 67.25,16.08 | 78.42,29.88 78.87,29.88 79.09,29.66 JP14.7 83.52,29.66 | 78.42,29.88 78.2,29.66 JP15.7 73.32,29.66 | 78.42,29.88 C23.1 | 68.22,29.88 68.58,29.88 68.79,29.66 JP16.7 73.32,29.66 | 68.22,29.88 68,29.66 JP17.7 63.02,29.66 | 68.22,29.88 C21.1 | S1.2 27.55,4.02 | 27.55,4.02 19.27,4.02 JP19.2 | v56.17,35.21 56.17,33.91 R9.2 | C26.2 13.07,43.84 14,44.77 14,45.47 | R29.1 10.92,24.09 v10.79,23.96 | C19.2 14.29,25.48 v14.29,26.13 14.02,26.4 C5.2 C1.2 14.02,31.89 15.01,32.87 C14.2 15.01,35.7 C28.2 | 4.75,25.19 6.44,26.89 C11.2 6.82,27.98 7.25,28.41
  Top 1.016: D100.1 4.75,25.19 | 4.75,25.19 5.48,24.45 U$3.7 | LED8.C 25.18,46.25 v25.18,43.79 26.11,43.79 C4.2 26.78,43.12 26.78,41.68 | C8.2 68.4,8.15 70.96,10.71 | C3.1 79.15,12.32 C17.1 77.89,10.7 | MOTOR3.2 MOTOR3.4 MOTOR3.6 MOTOR3.8 | MOTOR2.8 53.23,24.98 54.65,24.98 R4.2 56.6,26.93 56.99,26.93 58.49,28.43 58.49,29.66 JP18.7 63.02,29.66 | MOTOR2.6 MOTOR2.4 MOTOR2.2 | MOTOR0.8 53.93,40.58 55.02,40.58 56.21,41.77 R15.2 | MOTOR0.2 MOTOR0.4 MOTOR0.6 | JMP1.3 84.59,9.14 83.82,8.37 80.23,8.37 77.89,10.7 | 70.96,10.71 70.96,10.7 77.89,10.7 | 70.96,10.71 70.96,11.37 | 83.52,29.66 C24.1 | 73.32,29.66 C22.1 | C26.2 13,43.27 13,42.12 | JP19.10 JP19.12 JP19.14 | v15.68,45.47 14,45.47 | 7.25,28.41 v7.68,28.41 | 7.25,28.41 7.25,37.99 C100.- | 63.02,29.66 C20.1 | 12.7,41.79 13,42.09
  Bottom 1.016: 27.55,12.34 27.55,16.25 v28.11,16.81 | S1.1 27.55,12.34 | 27.55,12.34 v26.9,12.34 | JP19.10 9.12,2.53 11.23,2.53 JP19.6 14.21,2.52 16.3,2.52 JP19.2 | T1.1 51.2,9.33 51.2,8.71 48.8,6.31 | 48.8,6.31 v48.99,6.12 | JP10.5 46.95,6.31 48.8,6.31 | v11.17,19.95 10.79,20.32 v10.79,23.96 10.79,25.35 | 55.46,32.69 53.44,32.69 MOTOR1.8 50.89,31.21 MOTOR1.6 | 55.46,32.69 58.49,29.66 JP18.7 | 55.46,32.69 56.17,33.41 v56.17,35.21 | MOTOR1.2 44.34,32.68 43.07,33.96 43.07,37.34 MOTOR0.2 44.54,40.28 43.17,41.66 43.17,45.34 MOTOR3.2 | JP17.7 63.69,29.66 63.69,21.05 v60.99,18.36 JP5.2 | 21.14,39.95 21.34,39.95 v25.18,43.79 25.18,49.19 JP3.7 | v15.68,45.47 15.68,45.41 21.14,39.95 | 21.14,39.95 17.21,36.02 v17.21,29.44 14.29,26.52 v14.29,26.13 11.57,26.13 10.79,25.35 | v89.93,18.32 89.5,17.89 89.5,11.85 93.72,7.62 JP11.1 | MOTOR2.8 MOTOR2.6 | MOTOR0.6 MOTOR0.8 | 10.79,25.35 10.74,25.35 v7.68,28.41
HOLD  (via drill 0.41 pad 0.91)
  Top 0.203: MCU.39 31.19,32.94 25.16,26.91 v25.16,26.79
  Bottom 0.203: v25.16,26.79 21.36,22.99 20.17,22.99 14.93,17.75 14.93,12.38 14.21,11.67 14.21,6.1 15.26,5.06 JP19.4
INT_GYRO_3V  (via drill 0.41 pad 0.91)
  Top 0.203: U1.12 75.07,15.46 76.76,15.46 80.25,18.95 83.8,18.95 84.54,18.21 84.54,15.57 v84.04,15.06 U2.5 | TP4.TP v83.72,6.91
  Bottom 0.203: v83.72,6.91 84.04,7.23 v84.04,15.06
MISO_3V  (via drill 0.41 pad 0.91)
  Top 0.203: v69.21,10.86 66.89,10.86 60.85,16.91 56.08,16.91 55.87,17.11 38.55,17.11 35.66,20 35.66,21.01 34.51,22.15 TP37.TP 32.53,22.15 30.92,23.76 MCU.22 | U1.9 v76.03,13.73 | v72.05,9.51 72.4,9.51 76.22,5.7 TP2.TP | U2.3 83.31,16.37 83.71,16.76 83.71,17.87 83.45,18.13 81.55,18.13 v80.56,17.14
  Bottom 0.203: 71.98,10.35 75.36,13.73 v76.03,13.73 78.9,13.73 80.56,15.4 v80.56,17.14 | v72.05,9.51 71.98,9.58 71.98,10.35 | 71.98,10.35 69.72,10.35 v69.21,10.86
MOSI0
  Top 0.203: MOTOR0.5 49.62,35.23 49.71,35.14 R2.2
MOSI1
  Top 0.203: MOTOR1.5 49.42,27.63 49.51,27.54 R1.2
MOSI2
  Top 0.203: MOTOR2.5 49.22,19.93 49.31,19.84 R20.2
MOSI3
  Top 0.203: MOTOR3.5 49.72,43.23 49.81,43.14 R14.2
MOSI_3V  (via drill 0.41 pad 0.91)
  Top 0.203: U1.24 70.23,12.26 v67.82,12.26 | v64.93,10.56 59.42,16.06 56.06,16.06 55.42,16.71 38.38,16.71 34.57,20.51 TP38.TP 33.27,20.8 30.54,23.52 30.31,23.52 29.92,23.91 MCU.20 | U2.7 83.69,13.76 86.67,10.78 v86.67,7.24 88.27,5.64 TP6.TP
  Bottom 0.203: v67.82,12.26 66.11,10.56 v64.93,10.56 64.77,10.4 64.77,2.2 65.81,1.16 69.85,1.16 73.23,4.55 83.98,4.55 v86.67,7.24
N$1
  Top 0.203: MCU.5 22.42,22.45 C10.1
N$2
  Top 0.406: T1.2 55,11.87 55.03,11.84 LED7.C
  Top 0.508: JP2.2 53.35,7.62 52.6,7.62 51.43,8.79 51.43,10.05 T1.2
N$3  (1 unrouted)
N$5
  Top 0.203: C10.2 21.42,23.23 MCU.3
N$6
  Top 0.203: T1.3 53.25,13.29 52.55,13.29 50.66,11.4 R3.1
N$7
  Top 0.203: MCU.9 24.42,19.87 24.05,19.49 24.05,15.09 Q1.4
N$49
  Top 0.203: MCU.8 23.92,20.16 23.28,19.52 23.28,17.37 Q1.1
N$54
  Top 0.203: R26.1 22.92,20.95 MCU.6
N$73
  Top 0.508: U2.10 82.89,11.8 JMP1.2
N$84
  Top 0.203: R31.1 30.94,20.93 28.65,23.21 28.15,23.21 27.42,23.95 MCU.15
N$85
  Top 0.203: R42.2 LED7.A
N$96
  Top 0.203: U$3.4 8.67,17.44 C27.2
N$97
  Top 0.203: R38.2 LED3.A
N$109
  Top 0.203: U$3.6 6.75,25.12 C11.1 C9.1
N$120
  Top 0.203: R29.2 C9.2
N$121
  Top 0.203: U$3.1 2.52,19.14 C15.2
N$125
  Top 0.203: R36.1 R37.2 8.4,22.64 U$3.5
N$126
  Top 0.203: R27.2 2.25,48.46 LED1.A
N$127
  Top 0.203: R28.2 4.3,48.44 LED2.A
N$138
  Top 1.016: L1.1 1.92,26.44 D100.3 2.22,24.64 U$3.8 2.67,21.09 C15.1
N$149
  Top 0.203: R39.2 LED4.A
N$150
  Top 0.203: R40.2 LED5.A
N$161
  Top 0.203: R41.2 LED6.A
N$206
  Top 0.203: R43.2 25.18,47.83 LED8.A
P1_0
  Top 0.203: R38.1 6.55,46.65 10.4,42.8 10.4,41.11 12.99,38.53 15.79,38.53 16.88,37.44 MCU.78
P1_1
  Top 0.203: R39.1 8.52,45.26 11.02,42.76 11.02,41.07 13.15,38.93 16.83,38.93 17.83,37.94 MCU.77
P1_2
  Top 0.203: R40.1 10.62,43.73 11.43,42.93 11.43,41.24 12.73,39.93 17.43,39.93 MCU.76
P1_3  (via drill 0.41 pad 0.91)
  Top 0.203: R41.1 12.82,46.55 v12.82,45.56 | v17.52,40.69 19.67,40.69 MCU.75
  Bottom 0.203: v17.52,40.69 12.82,45.39 v12.82,45.56
P1_4
  Top 0.203: R43.1 22.63,46.05 19.38,42.79 19.38,42.09 20.22,41.25 20.66,41.25 20.92,40.99 MCU.74
P1_5
  Top 0.203: MCU.73 21.42,41.34 TP39.TP
P1_6
  Top 0.203: MCU.72 TP40.TP
P1_7
  Top 0.203: MCU.71 22.42,41.34 TP41.TP
P7_4  (via drill 0.41 pad 0.91)
  Top 0.203: TP43.TP v34.39,17.21 | MCU.24 31.92,23.95 32.26,23.61 32.97,23.61 v33.21,23.86
  Bottom 0.203: v33.21,23.86 33.01,23.65 33.01,17.86 33.65,17.21 v34.39,17.21 | v34.39,17.21
P7_5  (via drill 0.41 pad 0.91)
  Top 0.203: MCU.23 31.42,23.84 32.19,23.07 v34.64,23.07 | TP44.TP 33.75,18.17 v33.77,18.17
  Bottom 0.203: v33.77,18.17 34.64,19.05 v34.64,23.07
REGOUT
  Top 0.203: C3.2 77.13,14.51 75.74,14.51 75.49,14.27 U1.10
RESET  (via drill 0.41 pad 0.91)
  Top 0.203: MCU.10 24.83,24.85 R30.1 27.72,14.15 27.72,12.01 26.26,10.54 13.4,10.54 12.27,11.67 11.6,11.67 11.12,11.19 11.12,8.19 | 11.12,8.19 10.24,8.19 9.07,7.02 9.07,6.48 8.04,5.46 4.7,5.46 3.6,6.56 JP19.13 | S1.3 11.12,8.19 | v11.82,43.61 11.89,43.54 11.89,41.4 12.34,40.95 13.6,40.95 13.95,41.29 IC2.2
  Bottom 0.203: JP19.13 2.56,34.35 v11.82,43.61 | S1.4 S1.3
RESET_MOTOR_3V  (via drill 0.41 pad 0.91)
  Top 0.203: U2.9 83.83,12.46 85.55,10.74 85.55,7.77 84.95,7.17 84.95,5.57 84.07,4.68 79.58,4.68 TP8.TP 77.66,4.68 63.59,4.68 v63.22,4.3 | v29.38,26.58 28.92,26.12 MCU.18
  Bottom 0.203: v63.22,4.3 62.24,3.32 62.24,2.18 61.09,1.03 35.08,1.03 34.29,1.82 34.29,3.04 30.7,6.63 27.56,6.63 23.48,10.71 23.48,13.51 18.5,18.5 18.5,19.48 20.78,21.77 24.57,21.77 v29.38,26.58
RX2
  Top 0.203: MCU.40 34.91,33.44 35.46,33.99 35.46,35.86 36.58,36.98 36.58,38.61 38.1,40.13 49.82,40.13 50.7,39.24 50.7,38.7 51.68,37.72 55.09,37.72 57.26,39.89 57.26,43.06 58.73,44.53 58.73,45.15 59.91,46.32 74.4,46.32 TP36.TP 76.02,50.63 JP1.5
RX3  (via drill 0.41 pad 0.91)
  Top 0.203: MCU.45 33.88,35.98 30.64,35.98 v28.82,34.16 | v31.56,46.86 41.82,46.86 43.7,48.74 57.48,48.74 59.21,47 69.98,47 TP33.TP JP1.7
  Bottom 0.203: v31.56,46.86 31.56,43.61 27.81,39.86 27.81,35.17 v28.82,34.16
SCLK_3V  (via drill 0.41 pad 0.91)
  Top 0.203: MCU.21 30.42,25.98 30.7,26.25 31.92,26.25 v32.25,26.58 | v48.42,19.34 48.42,18.2 48.99,17.63 57.3,17.63 57.43,17.5 62.41,17.5 66.68,13.23 v69.51,13.23 U1.23 | 84.98,14.28 84.98,18.34 82.54,20.78 v77.06,20.78 | 84.98,14.28 84.98,13.26 89.9,8.34 89.9,5.32 89.26,4.68 87.28,4.68 TP5.TP | U2.6 83.04,14.28 84.98,14.28
  Bottom 0.203: v48.42,19.34 44.24,19.34 39.53,24.04 39.53,25.41 38.36,26.58 v32.25,26.58 | v77.06,20.78 v69.51,13.23
TX2  (via drill 0.41 pad 0.91)
  Top 0.203: v36.26,35.08 36.26,33.73 34.98,32.44 MCU.38 | v41.46,48.15 41.72,48.15 43.27,49.69 43.27,50.21 45.23,52.18 72.19,52.18 JP1.6 73.46,48 TP35.TP
  Bottom 0.203: v41.46,48.15 41.46,40.27 v36.26,35.08
TX3  (via drill 0.41 pad 0.91)
  Top 0.203: v39.41,47.62 39.64,47.39 41.77,47.39 43.58,49.19 68.32,49.19 | JP1.8 68.38,49.25 68.32,49.19 | TP34.TP 68.32,49.19 | v35.57,37.08 34.93,36.44 MCU.46
  Bottom 0.203: v39.41,47.62 39.41,39.22 37.26,37.08 v35.57,37.08
VIN  (via drill 0.41 pad 0.91)
  Top 0.508: 44.85,8.35 33.51,8.35 32.11,9.76 13.06,9.76 v11.92,10.9 | C8.1 61.02,10.83 R42.1 56.89,14.96 55.8,14.96 55.03,15.73 52.23,15.73 44.85,8.35 | 6.21,14.03 5.37,13.19 C13.1 | v7.97,14.07 6.24,14.07 6.21,14.03 | 6.21,14.03 5.27,14.96 | 5.27,14.96 R35.2 5.48,15.25 U$3.2 | 5.27,14.96 C30.+ | 44.85,8.35 45.77,7.43 C7.1 45.72,5.49 JP10.6 | JP2.1 JP5.1
  Bottom 0.508: v7.97,14.07 11.14,10.9 v11.92,10.9 | JP2.1 54.67,5.94 54.67,4.98 53.76,4.07 47.5,4.07 JP10.6
WR  (via drill 0.41 pad 0.91)
  Top 0.203: v24.37,32.96 29.24,32.96 31.85,35.57 32.48,35.57 32.62,35.44 MCU.44
  Bottom 0.203: v24.37,32.96 12.51,21.1 12.51,11.83 12.69,11.65 12.69,10.1 10.18,7.6 JP19.7
XIN
  Top 0.203: MCU.13 26.42,23.32 27.52,22.22 Y1.3
XOUT
  Top 0.203: Y1.1 25.42,21 MCU.11

## Text on the board
tPlace: 22 | 14 | 15 | 16 | 17 | 18 | 19 | 20 | 21 | 24 | 26 | 28 | 30 | 31 | 32 | 33 | 34 | 35 | 36 | 37 | 38 | 39 | 40 | 41 | 42 | 43 | 44 | 45 | 46 | 47 | 48 | 49 | 50 | 51 | 52 | 53 | ANALOG IN | 0 | 1 | 2 | 3 | 4 | 5 | 6 | 7 | 8 | 9 | 10 | 11 | 12 | 13 | 14 | 15 | RES | RESET
tNames: GND | AREF | TX | RX | DIGITAL | RX3 | TX2 | GND | IOREF | 3V3 | 5V | GND | VIN